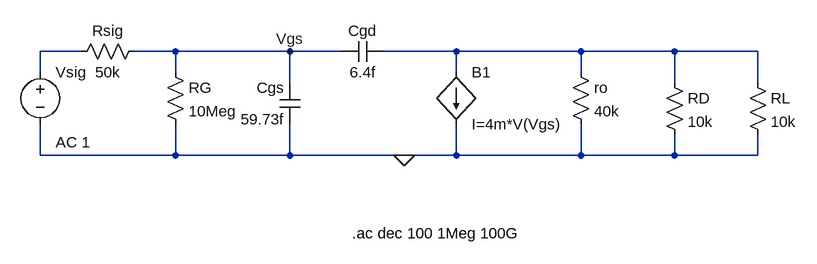
[diagram p0: schematic MOSFET Loaded.asc]
MOSFET Loaded.asc, the LTspice schematic file:
Version 4.1
SHEET 1 880 680
WIRE -240 128 -304 128
WIRE -96 128 -160 128
WIRE 80 128 -96 128
WIRE 160 128 80 128
WIRE 336 128 224 128
WIRE 528 128 336 128
WIRE 672 128 528 128
WIRE 800 128 672 128
WIRE -304 160 -304 128
WIRE -96 160 -96 128
WIRE 336 160 336 128
WIRE 528 160 528 128
WIRE 80 176 80 128
WIRE 672 176 672 128
WIRE 800 176 800 128
WIRE -304 288 -304 240
WIRE -96 288 -96 240
WIRE -96 288 -304 288
WIRE 80 288 80 240
WIRE 80 288 -96 288
WIRE 256 288 80 288
WIRE 336 288 336 240
WIRE 336 288 256 288
WIRE 528 288 528 240
WIRE 528 288 336 288
WIRE 672 288 672 256
WIRE 672 288 528 288
WIRE 800 288 800 256
WIRE 800 288 672 288
FLAG 256 288 0
FLAG 80 128 Vgs
SYMBOL cap 224 112 R90
WINDOW 0 0 32 VBottom 2
WINDOW 3 32 32 VTop 2
SYMATTR InstName Cgd
SYMATTR Value 6.4f
SYMBOL cap 96 240 R180
WINDOW 0 24 56 Left 2
WINDOW 3 24 8 Left 2
SYMATTR InstName Cgs
SYMATTR Value 59.73f
SYMBOL res 512 144 R0
SYMATTR InstName ro
SYMATTR Value 40k
SYMBOL bi 336 160 R0
SYMATTR InstName B1
SYMATTR Value I=4m*V(Vgs)
SYMBOL res 656 160 R0
SYMATTR InstName RD
SYMATTR Value 10k
SYMBOL res 784 160 R0
SYMATTR InstName RL
SYMATTR Value 10k
SYMBOL res -112 144 R0
SYMATTR InstName RG
SYMATTR Value 10Meg
SYMBOL res -144 112 R90
WINDOW 0 0 56 VBottom 2
WINDOW 3 32 56 VTop 2
SYMATTR InstName Rsig
SYMATTR Value 50k
SYMBOL voltage -304 144 R0
WINDOW 123 24 124 Left 2
WINDOW 39 0 0 Left 0
SYMATTR InstName Vsig
SYMATTR Value ""
SYMATTR Value2 AC 1
TEXT 176 408 Left 2 !.ac dec 100 1Meg 100G

The netlist it stands for:
* MOSFET Loaded.asc
Cgd N002 Vgs 6.4f
Cgs 0 Vgs 59.73f
ro N002 0 40k
B1 N002 0 I=4m*V(Vgs)
RD N002 0 10k
RL N002 0 10k
RG Vgs 0 10Meg
Rsig Vgs N001 50k
Vsig N001 0 AC 1
.ac dec 100 1Meg 100G
.backanno
.end